# EasyEDA schematic SCH_robotica_2023-06-20.json
TITLE: Sheet_1; REV: 1.0; Date: 2023-05-13; Sheet: 1/1; Drawn By: omglocura; Company: Your Company
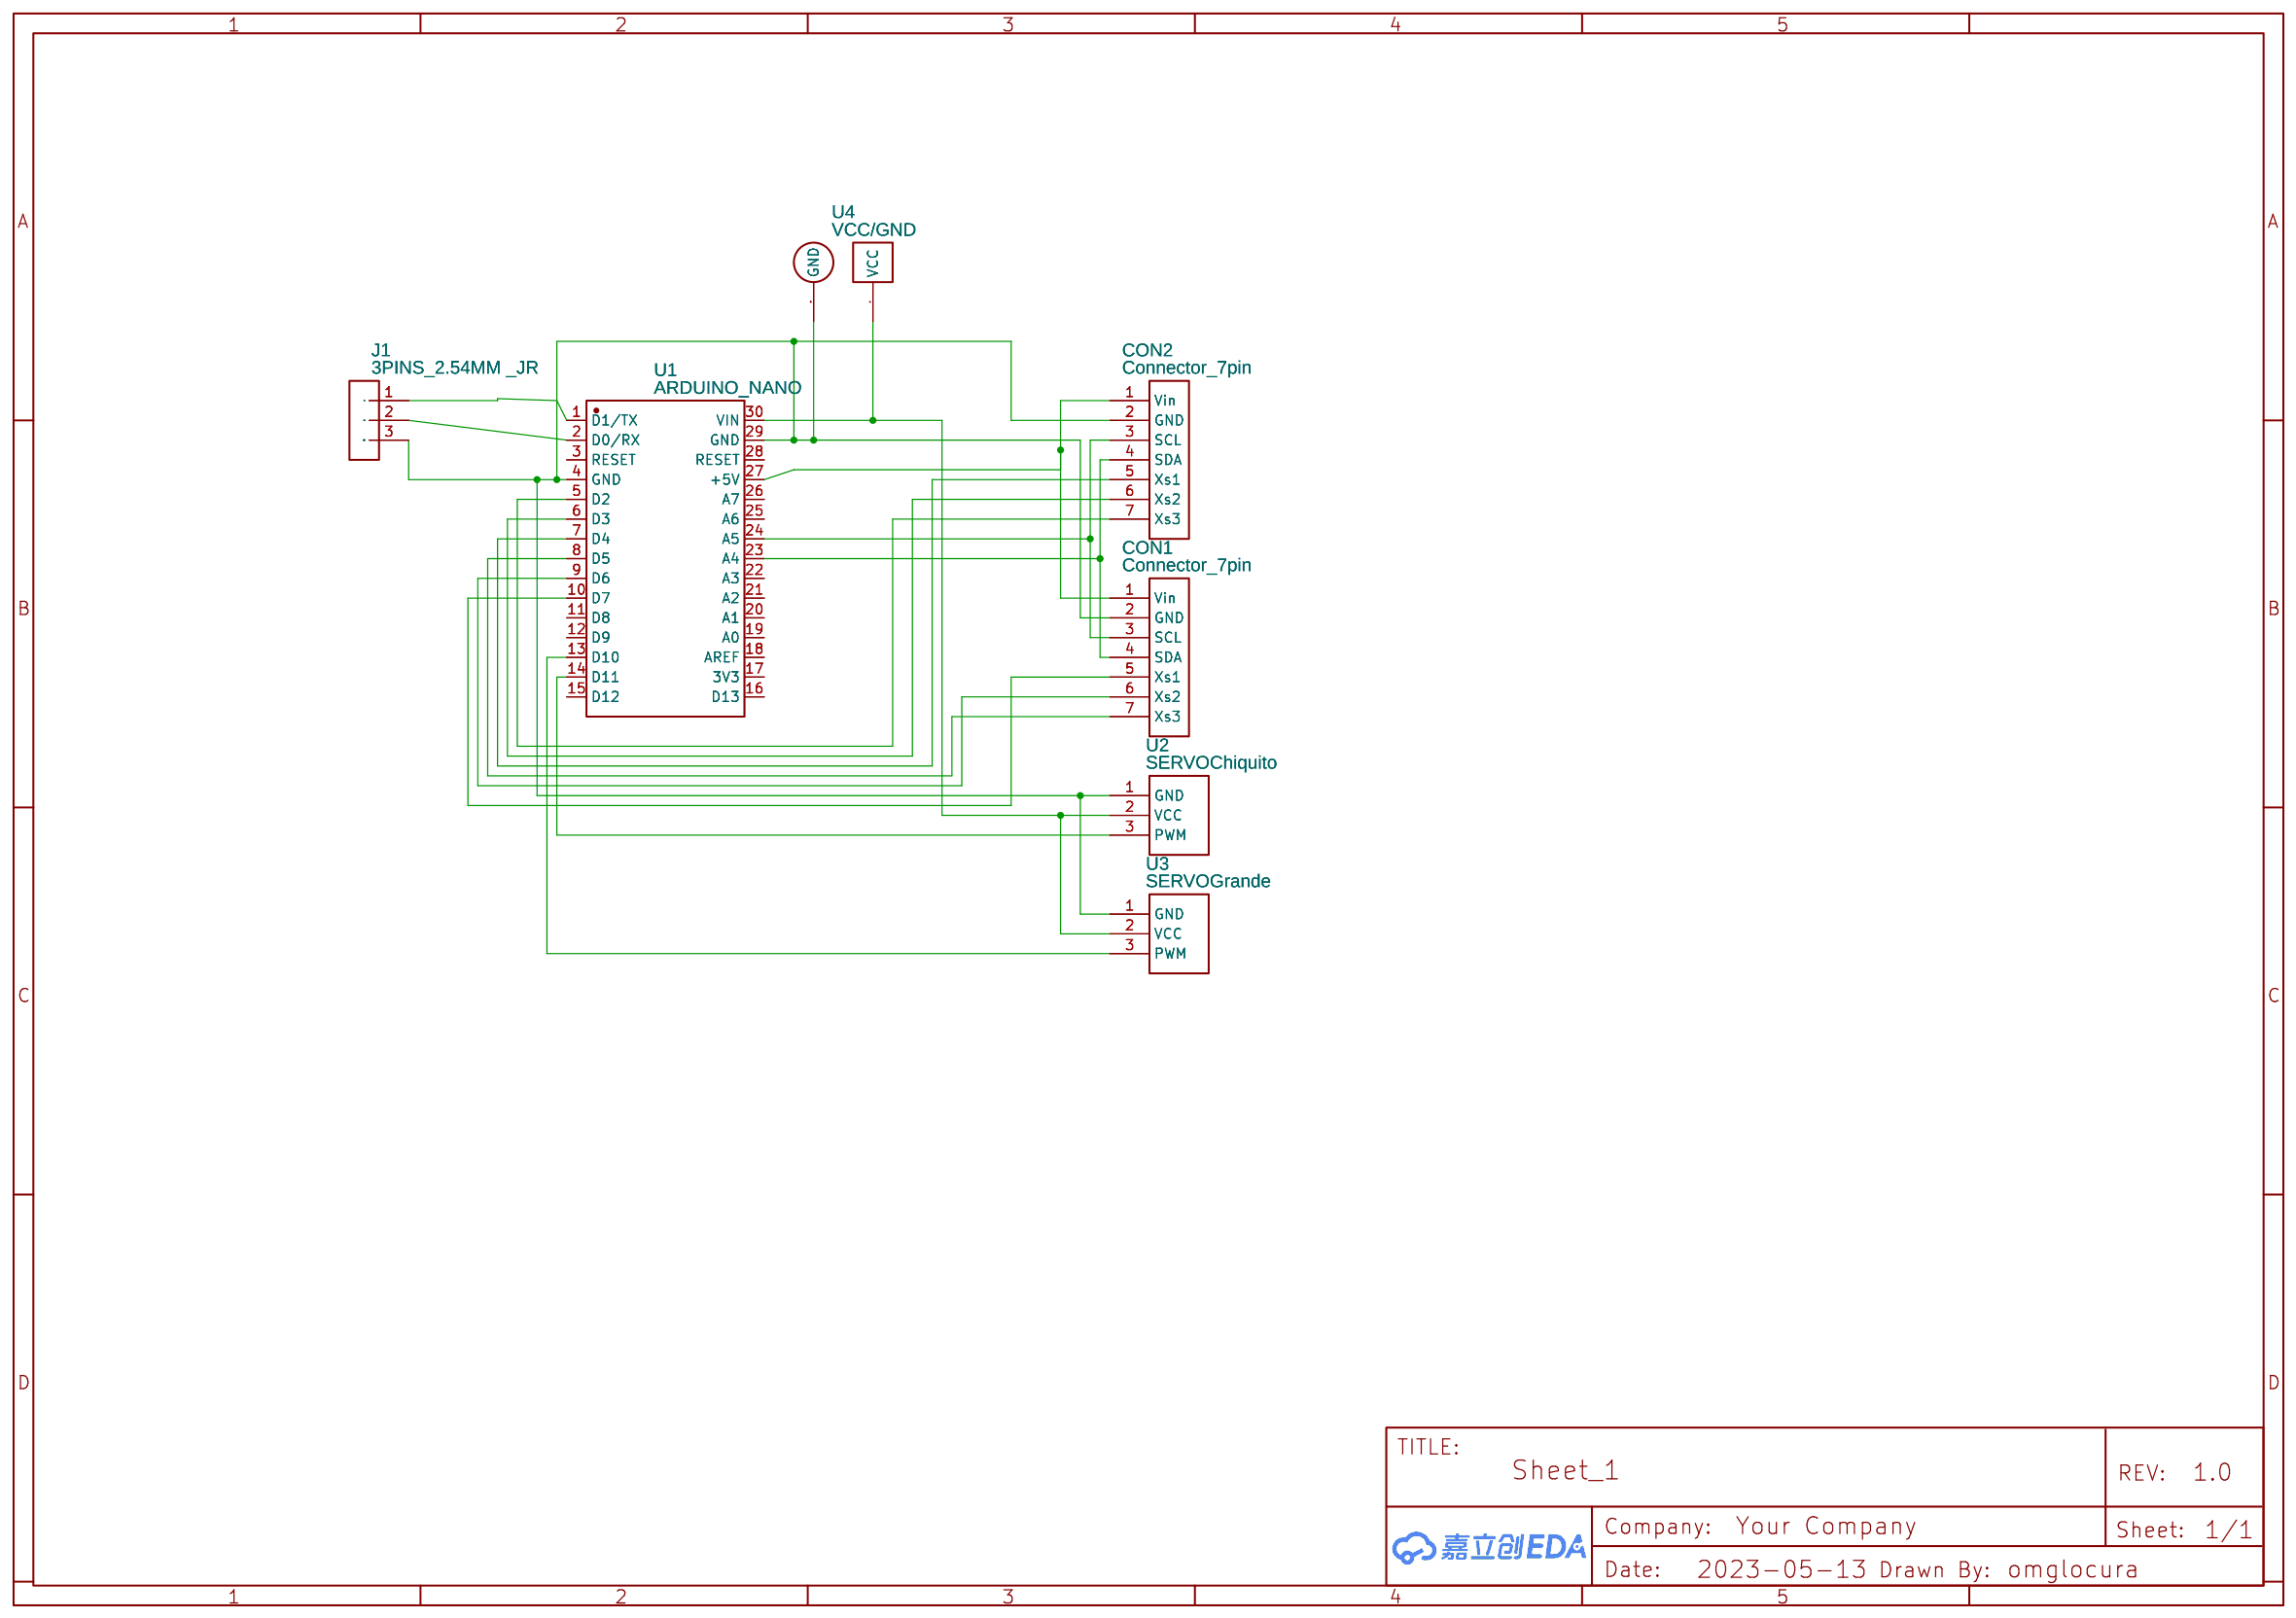
[diagram p0: schematic sheet]

## Parts
CON1  Connector_7pin  [CONNECTOR_7PIN]
CON2  Connector_7pin  [CONNECTOR_7PIN]
J1  3PINS_2.54MM _JR  [CONNECTOR - 3PIN]
U1  ARDUINO_NANO  [COMM-TH_ARDUINO_NANO]
U2  SERVOChiquito  [SERVOPINS]
U3  SERVOGrande  [SERVOPINS]
U4  VCC/GND  [VCC/GND 2PIN]

## Library data of the parts
CON1 CON2 = Connector_7pin: Contributor: panos
J1 = 3PINS_2.54MM _JR: Supplier Part: undefined; Supplier: Tayda; Contributor: Sarathlal
U1 = ARDUINO_NANO: Supplier: LCSC; Supplier Part: C9900017879; Manufacturer: null; JLCPCB Part Class: Extended Part; Contributor: lcsc
U2 U3 = SERVOPINS: Contributor: lizzie
U4 = VCC/GND: Manufacturer: CHH; Supplier Part: TUANHUNG; Contributor: arcenal111

## Nets
Net-(CON1-1): CON1.1(Vin) CON2.1(Vin) U1.27(+5V)
Net-(CON1-2): CON1.2(GND) CON2.2(GND) J1.3(GND) U1.4(GND) U1.29(GND) U2.1(GND) U3.1(GND) U4.2(GND)
Net-(CON1-3): CON1.3(SCL) CON2.3(SCL) U1.24(A5)
Net-(CON1-4): CON1.4(SDA) CON2.4(SDA) U1.23(A4)
Net-(CON1-5): CON1.5(Xs1) U1.10(D7)
Net-(CON1-6): CON1.6(Xs2) U1.9(D6)
Net-(CON1-7): CON1.7(Xs3) U1.8(D5)
Net-(CON2-5): CON2.5(Xs1) U1.7(D4)
Net-(CON2-6): CON2.6(Xs2) U1.6(D3)
Net-(CON2-7): CON2.7(Xs3) U1.5(D2)
Net-(J1-1): J1.1(Tx) U1.1(D1/TX)
Net-(J1-2): J1.2(Rx) U1.2(D0/RX)
Net-(U1-13): U1.13(D10) U3.3(PWM)
Net-(U1-14): U1.14(D11) U2.3(PWM)
Net-(U1-30): U1.30(VIN) U2.2(VCC) U3.2(VCC) U4.1(VCC)

Not connected (* = marked no-connect by the designer): U1 3(RESET) 11(D8) 12(D9) 15(D12) 16(D13) 17(3V3) 18(AREF) 19(A0) 20(A1) 21(A2) 22(A3) 25(A6) 26(A7) 28(RESET)
